# EAGLE design BatteryManagerV1 (EAGLE 5.12)

## Sheet 1 of 3
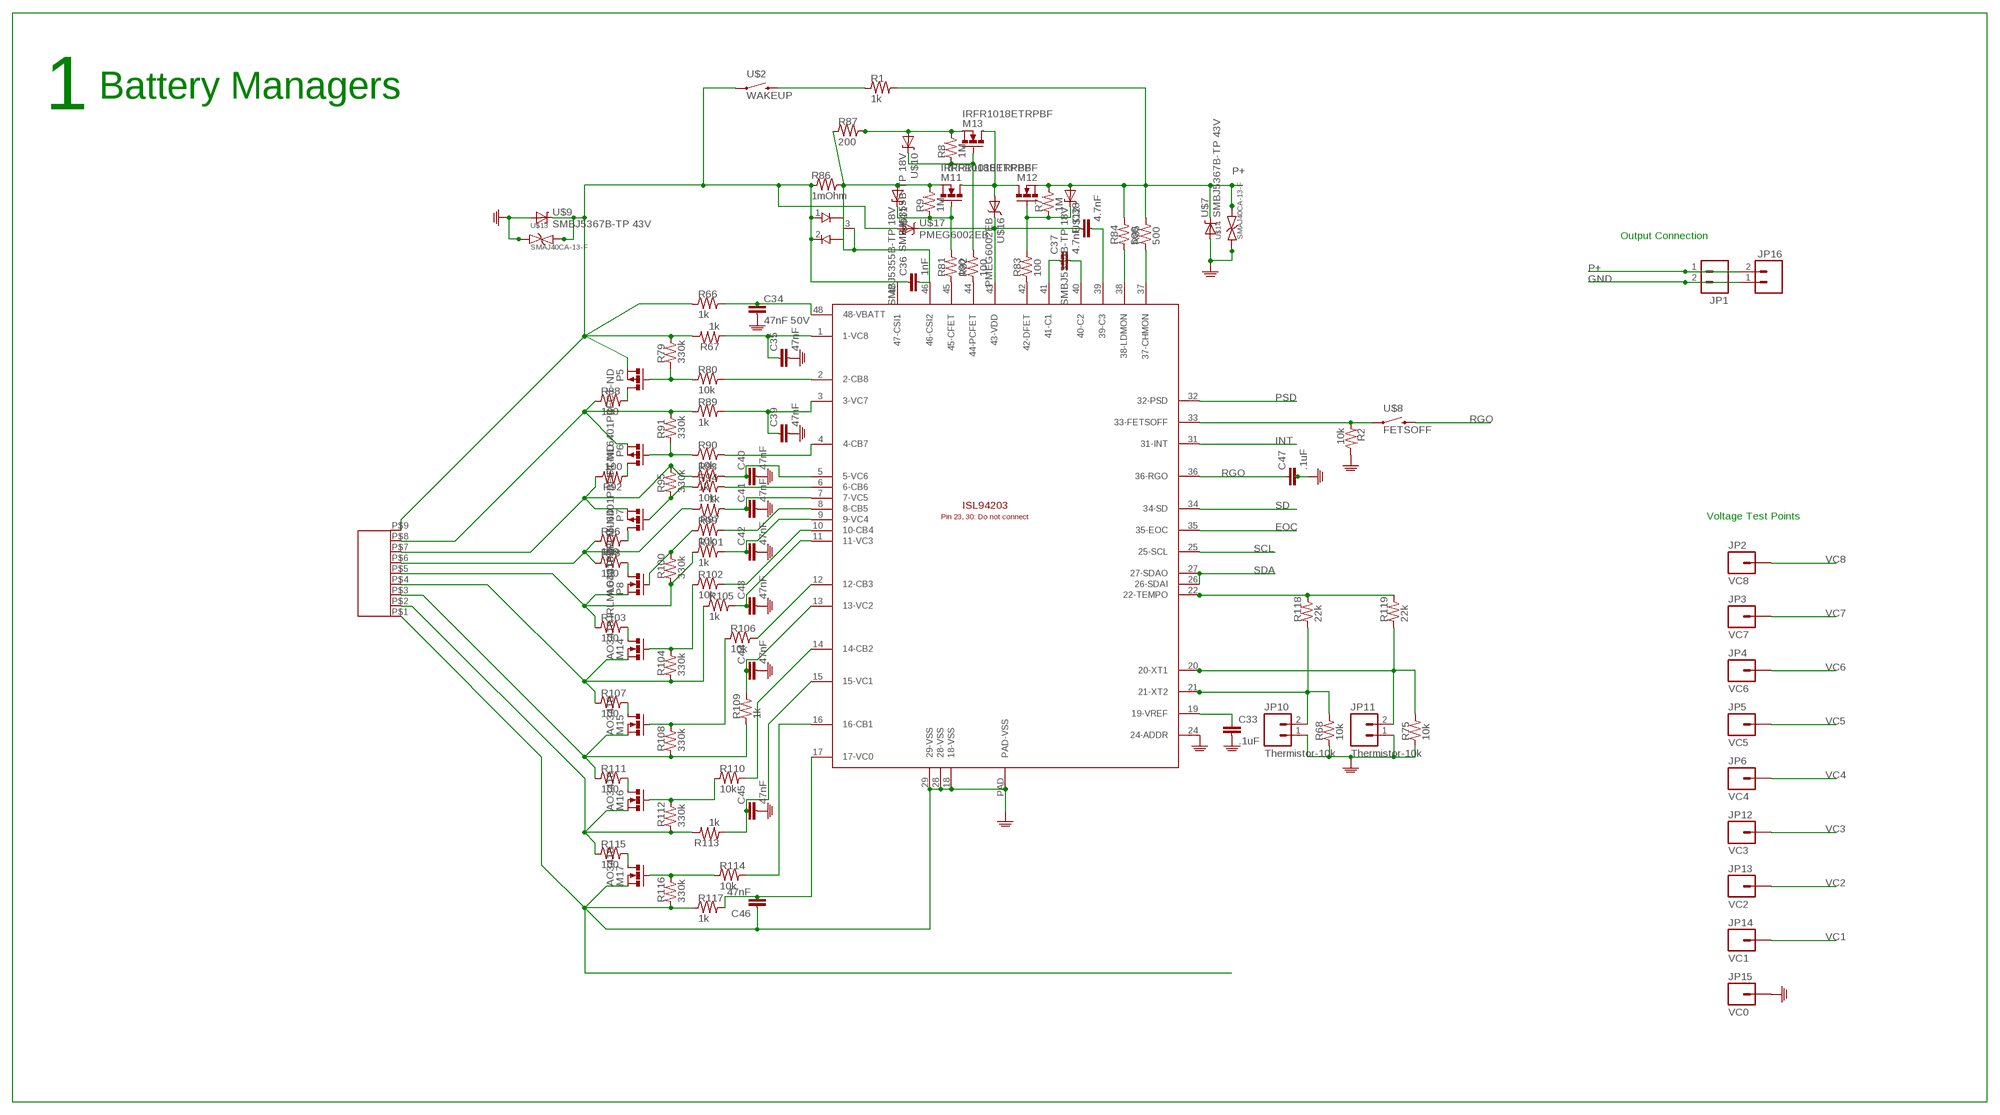
[diagram p0: schematic, sheet 1]

### Parts
C33  .1uF  CAP0603  [0603]
C34  47nF 50V  CAP0603  [0603]
C35  47nF  CAP0603  [0603]
C36  1nF  CAP0603  [0603]
C37  4.7nF  CAP0603  [0603]
C38  4.7nF  CAP0603  [0603]
C39  47nF  CAP0603  [0603]
C40  47nF  CAP0603  [0603]
C41  47nF  CAP0603  [0603]
C42  47nF  CAP0603  [0603]
C43  47nF  CAP0603  [0603]
C44  47nF  CAP0603  [0603]
C45  47nF  CAP0603  [0603]
C46  47nF  CAP0603  [0603]
C47  .1uF  CAP0603  [0603]
JP1  M02MINI-MATENLOK-2  [TE-MINIMATENLOK-2]
JP2  VC8  M01TEST  [1X01_TEST]
JP3  VC7  M01TEST  [1X01_TEST]
JP4  VC6  M01TEST  [1X01_TEST]
JP5  VC5  M01TEST  [1X01_TEST]
JP6  VC4  M01TEST  [1X01_TEST]
JP10  Thermistor-10k  M02JST-PH-TH  [JST-2-PH-TH]
JP11  Thermistor-10k  M02JST-PH-TH  [JST-2-PH-TH]
JP12  VC3  M01TEST  [1X01_TEST]
JP13  VC2  M01TEST  [1X01_TEST]
JP14  VC1  M01TEST  [1X01_TEST]
JP15  VC0  M01TEST  [1X01_TEST]
JP16  M02JST-PH-TH  [JST-2-PH-TH]
M11  IRFR1018ETRPBF  N-MOSDPAK  [DPAK]
M12  IRFR1018ETRPBF  N-MOSDPAK  [DPAK]
M13  IRFR1018ETRPBF  N-MOSDPAK  [DPAK]
M14  AO3418  N-MOSSOT23F  [SOT23F]
M15  AO3418  N-MOSSOT23F  [SOT23F]
M16  AO3418  N-MOSSOT23F  [SOT23F]
M17  AO3418  N-MOSSOT23F  [SOT23F]
P5  IRLML6401PBFCT-ND  P-MOSSOT23F  [SOT23F]
P6  IRLML6401PBFCT-ND  P-MOSSOT23F  [SOT23F]
P7  IRLML6401PBFCT-ND  P-MOSSOT23F  [SOT23F]
P8  AO3418  N-MOSSOT23F  [SOT23F]
R1  1k  R0603  [0603]
R2  10k  R0603  [0603]
R7  1M  R0603  [0603]
R8  1M  R0603  [0603]
R9  1M  R0603  [0603]
R66  1k  R0603  [0603]
R67  1k  R0603  [0603]
R68  10k  R0603  [0603]
R75  10k  R0603  [0603]
R79  330k  R0603  [0603]
R80  10k  R0603  [0603]
R81  100  R0603  [0603]
R82  100  R0603  [0603]
R83  100  R0603  [0603]
R84  500  R0603  [0603]
R85  500  R0603  [0603]
R86  1mOhm  R-SHORT1206  [1206]
R87  200  R0603  [0603]
R88  100  R0603  [0603]
R89  1k  R0603  [0603]
R90  10k  R0603  [0603]
R91  330k  R0603  [0603]
R92  100  R0603  [0603]
R93  1k  R0603  [0603]
R94  10k  R0603  [0603]
R95  330k  R0603  [0603]
R96  100  R0603  [0603]
R97  1k  R0603  [0603]
R98  100  R0603  [0603]
R99  10k  R0603  [0603]
R100  330k  R0603  [0603]
R101  1k  R0603  [0603]
R102  10k  R0603  [0603]
R103  100  R0603  [0603]
R104  330k  R0603  [0603]
R105  1k  R0603  [0603]
R106  10k  R0603  [0603]
R107  100  R0603  [0603]
R108  330k  R0603  [0603]
R109  1k  R0603  [0603]
R110  10k  R0603  [0603]
R111  100  R0603  [0603]
R112  330k  R0603  [0603]
R113  1k  R0603  [0603]
R114  10k  R0603  [0603]
R115  100  R0603  [0603]
R116  330k  R0603  [0603]
R117  1k  R0603  [0603]
R118  22k  R0603  [0603]
R119  22k  R0603  [0603]
U$1  JST-9-PH  [JST-9-PH]
U$2  WAKEUP  TACTILE_SWITCH  [TACTILE_SWITCH]
U$6  ISL94203  [TQFPNL-48]
U$7  SMBJ5367B-TP 43V  DIODE-ZENERSMB  [SMB-DIODE]
U$8  FETSOFF  TACTILE_SWITCH  [TACTILE_SWITCH]
U$9  SMBJ5367B-TP 43V  DIODE-ZENERSMB  [SMB-DIODE]
U$10  SMBJ5355B-TP 18V  DIODE-ZENERSMB  [SMB-DIODE]
U$11  SMBJ5355B-TP 18V  DIODE-ZENERSMB  [SMB-DIODE]
U$12  SMBJ5355B-TP 18V  DIODE-ZENERSMB  [SMB-DIODE]
U$13  SMAJ40CA-13-F  [SMA-DIODE]
U$14  SMAJ40CA-13-F  [SMA-DIODE]
U$15  MMBD7000HS-7-F  [SOT23-3]
U$16  PMEG6002EB  [SOD-523]
U$17  PMEG6002EB  [SOD-523]

### Nets
EOC: U$6.35(35-EOC) ; also sheet 2
GND: C33.2 C34.2 C35.2 C39.2 C40.2 C41.2 C42.2 C43.2 C44.2 C45.2 C46.1 C47.2 JP1.2 JP10.1 JP11.1 JP15.1 JP16.1 M17.S R2.2 R68.1 R75.1 R116.1 R117.1 U$1.P$1 U$6.18(18-VSS) U$6.24(24-ADDR) U$6.28(28-VSS) U$6.29(29-VSS) U$6.PAD(PAD-VSS) U$7.A U$9.A U$13.A U$14.A ; also sheet 2,3
INT: U$6.31(31-INT) ; also sheet 2
N$1: R1.1 U$2.2
N$2: R2.1 U$6.33(33-FETSOFF) U$8.1
N$4: M11.D M12.D M13.D U$16.A
N$7: C36.2 M11.S R9.2 R86.2 R87.1 U$6.46(46-CSI2) U$11.A U$15.3
N$92: C33.1 U$6.19(19-VREF)
N$93: C34.1 R66.2 U$6.48(48-VBATT)
N$94: C35.1 R67.1 U$6.1(1-VC8)
N$105: R80.2 U$6.2(2-CB8)
N$106: P5.G R79.1 R80.1
N$107: C39.1 R89.2 U$6.3(3-VC7)
N$110: M11.G R9.1 R81.2 U$11.C
N$111: M13.G R8.1 R82.2 U$10.C
N$112: C38.1 U$6.43(43-VDD) U$16.C U$17.C
N$113: M12.G R7.1 R83.2 U$12.C
N$114: C37.1 U$6.41(41-C1)
N$115: C37.2 U$6.40(40-C2)
N$116: C38.2 U$6.39(39-C3)
N$117: R84.1 U$6.38(38-LDMON)
N$118: R85.1 U$6.37(37-CHMON)
N$119: M13.S R8.2 R87.2 U$10.A
N$120: P5.D R88.2
N$121: R90.2 U$6.4(4-CB7)
N$123: P6.G R90.1 R91.1
N$124: P6.D R92.1
N$126: P7.G R94.1 R95.1
N$127: R94.2 U$6.6(6-CB6)
N$128: C40.1 R93.2 U$6.5(5-VC6)
N$129: P7.D R96.2
N$130: C41.1 R97.1 U$6.7(7-VC5)
N$132: P8.D R98.2
N$133: R99.2 U$6.8(8-CB5)
N$134: P8.G R99.1 R100.2
N$135: C42.1 R101.2 U$6.9(9-VC4)
N$137: R102.2 U$6.10(10-CB4)
N$138: M14.G R102.1 R104.2
N$139: M14.D R103.2
N$140: C43.1 R105.2 U$6.11(11-VC3)
N$142: R106.2 U$6.12(12-CB3)
N$143: M15.G R106.1 R108.2
N$144: M15.D R107.2
N$145: C44.1 R109.2 U$6.13(13-VC2)
N$147: M16.G R110.1 R112.2
N$148: R110.2 U$6.14(14-CB2)
N$149: M16.D R111.2
N$150: C45.1 R113.1 U$6.15(15-VC1)
N$152: R114.2 U$6.16(16-CB1)
N$153: M17.G R114.1 R116.2
N$154: M17.D R115.2
N$155: C46.2 R117.2 U$6.17(17-VC0)
N$156: R81.1 U$6.45(45-CFET)
N$157: R82.1 U$6.44(44-PCFET)
N$158: R83.1 U$6.42(42-DFET)
N$159: R118.2 R119.2 U$6.22(22-TEMPO)
N$160: JP11.2 R75.2 R119.1 U$6.20(20-XT1)
N$161: JP10.2 R68.2 R118.1 U$6.21(21-XT2)
P+: JP1.1 JP16.2 M12.S R1.2 R7.2 R84.2 R85.2 U$7.C U$12.A U$14.C
PSD: U$6.32(32-PSD) ; also sheet 2
RGO: C47.1 U$6.36(36-RGO) U$8.2 ; also sheet 2
SCL: U$6.25(25-SCL) ; also sheet 2
SD: U$6.34(34-SD) ; also sheet 2
SDA: U$6.26(26-SDAI) U$6.27(27-SDAO) ; also sheet 2
VC1: JP14.1 M16.S R112.1 R113.2 R115.1 U$1.P$2
VC2: JP13.1 M15.S R108.1 R109.1 R111.1 U$1.P$3
VC3: JP12.1 M14.S R104.1 R105.1 R107.1 U$1.P$4
VC4: JP6.1 P8.S R100.1 R101.1 R103.1 U$1.P$5
VC5: JP5.1 R96.1 R97.2 R98.1 U$1.P$6
VC6: JP4.1 P7.S R92.2 R93.1 R95.2 U$1.P$7
VC7: JP3.1 P6.S R88.1 R89.1 R91.2 U$1.P$8
VC8: C36.1 JP2.1 P5.S R66.1 R67.2 R79.2 R86.1 U$1.P$9 U$2.1 U$6.47(47-CSI1) U$9.C U$13.C U$15.1 U$15.2 U$17.A

### Notes on the sheet
- 1 | Battery Managers
- Output Connection
- Voltage Test Points

## Sheet 2 of 3
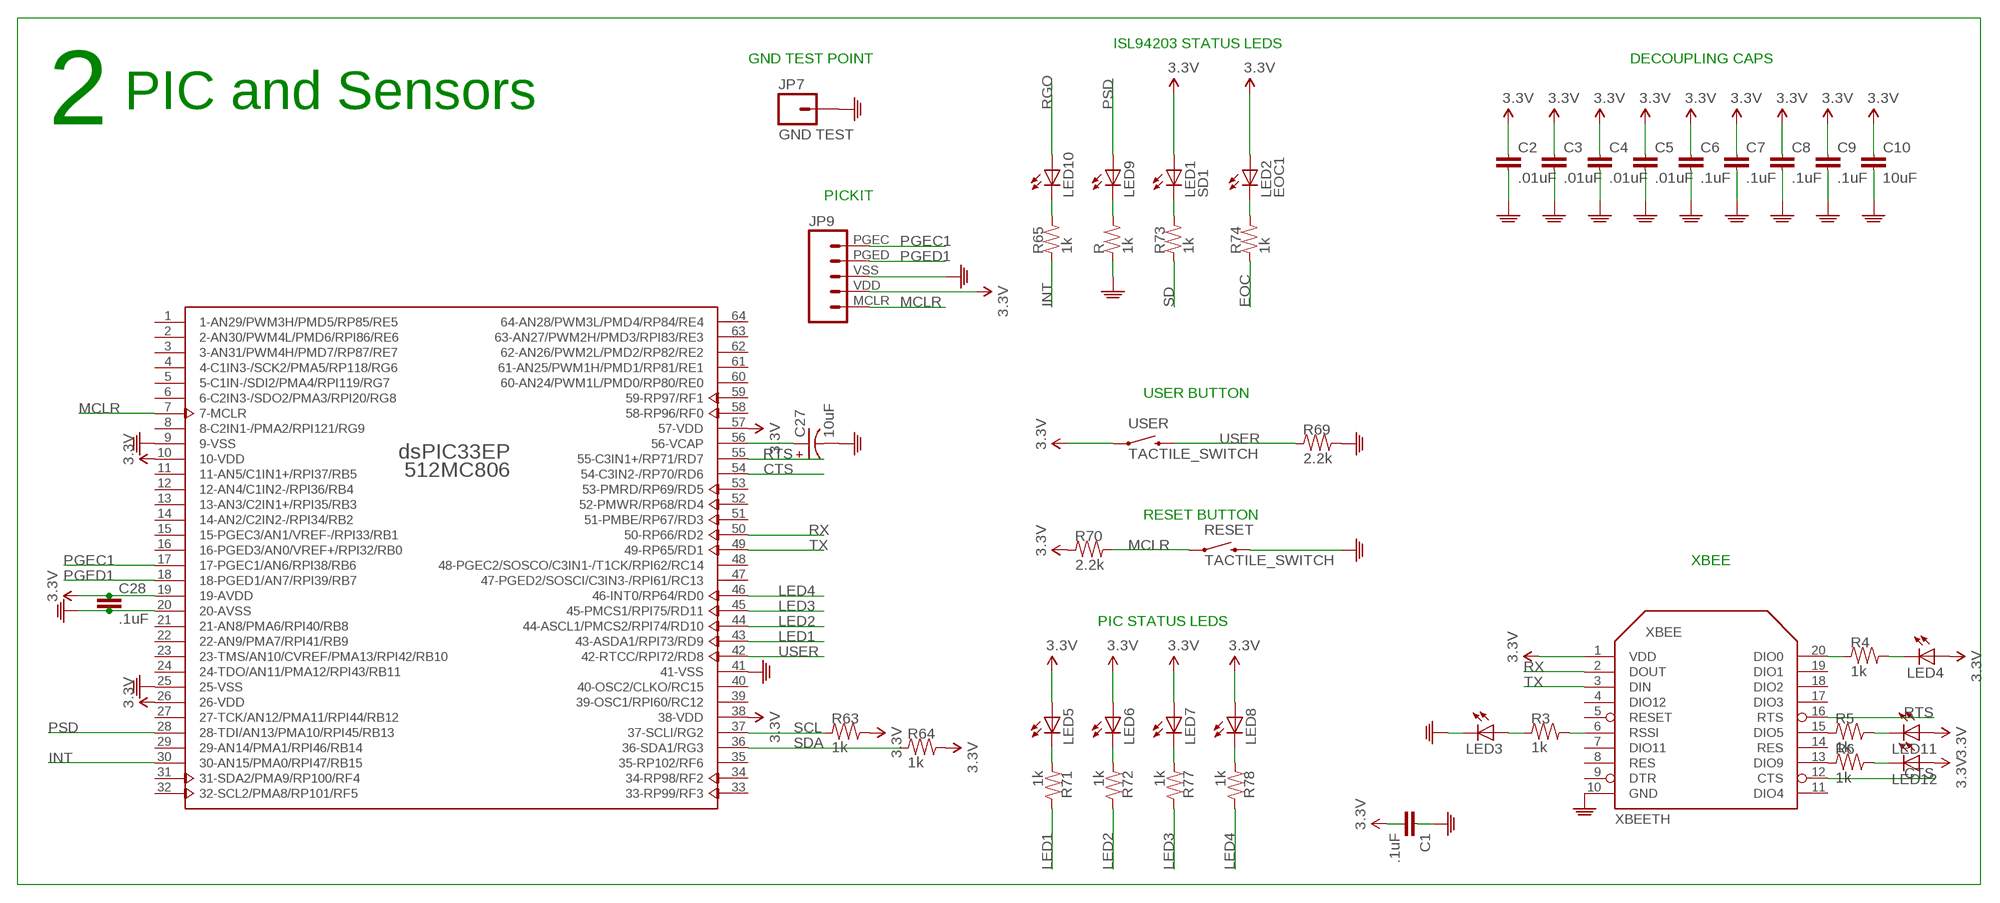
[diagram p1: schematic, sheet 2]

### Parts
C1  .1uF  CAP1206  [1206]
C2  .01uF  CAP0603  [0603]
C3  .01uF  CAP0603  [0603]
C4  .01uF  CAP0603  [0603]
C5  .01uF  CAP0603  [0603]
C6  .1uF  CAP0603  [0603]
C7  .1uF  CAP0603  [0603]
C8  .1uF  CAP0603  [0603]
C9  .1uF  CAP0603  [0603]
C10  10uF  CAP1206  [1206]
C27  10uF  CAP-POL0603  [0603-POL]
C28  .1uF  CAP0603  [0603]
JP7  GND TEST  M01PTH  [1X01]
JP9  M05PICKIT3  [1X05-PICKIT3]
LED1  SD1  LED0603  [0603-DIODE]
LED2  EOC1  LED0603  [0603-DIODE]
LED3  LED0603  [0603-DIODE]
LED4  LED0603  [0603-DIODE]
LED5  LED5MM  [LED5MM]
LED6  LED5MM  [LED5MM]
LED7  LED5MM  [LED5MM]
LED8  LED5MM  [LED5MM]
LED9  LED0603  [0603-DIODE]
LED10  LED0603  [0603-DIODE]
LED11  LED0603  [0603-DIODE]
LED12  LED0603  [0603-DIODE]
R  1k  R0603  [0603]
R3  1k  R0603  [0603]
R4  1k  R0603  [0603]
R5  1k  R0603  [0603]
R6  1k  R0603  [0603]
R63  1k  R0402  [0402]
R64  1k  R0402  [0402]
R65  1k  R0603  [0603]
R69  2.2k  R0603  [0603]
R70  2.2k  R0603  [0603]
R71  1k  R0603  [0603]
R72  1k  R0603  [0603]
R73  1k  R0603  [0603]
R74  1k  R0603  [0603]
R77  1k  R0603  [0603]
R78  1k  R0603  [0603]
RESET  TACTILE_SWITCH  [TACTILE_SWITCH]
U$3  DSPIC33EP512MC806  [TQFP64_10X10]
USER  TACTILE_SWITCH  [TACTILE_SWITCH]
XBEE  XBEETH  [XBEE-SILK]

### Nets
3.3V: C1.2 C2.1 C3.1 C4.1 C5.1 C6.1 C7.1 C8.1 C9.1 C10.1 C28.1 JP9.VDD LED1.AN(A) LED2.AN(A) LED4.AN(A) LED5.A LED6.A LED7.A LED8.A LED11.AN(A) LED12.AN(A) R63.2 R64.2 R70.1 U$3.10(10-VDD) U$3.19(19-AVDD) U$3.26(26-VDD) U$3.38(38-VDD) U$3.57(57-VDD) USER.1 XBEE.1(VDD) ; also sheet 3
CTS: U$3.54(54-C3IN2-/RP70/RD6) XBEE.12(CTS)
EOC: R74.1 ; also sheet 1
GND: C1.1 C2.2 C3.2 C4.2 C5.2 C6.2 C7.2 C8.2 C9.2 C10.2 C27.- C28.2 JP7.1 JP9.VSS LED3.CAT(C) R69.2 R.1 RESET.2 U$3.9(9-VSS) U$3.20(20-AVSS) U$3.25(25-VSS) U$3.41(41-VSS) XBEE.10(GND) ; also sheet 1,3
INT: R65.1 U$3.30(30-AN15/PMA0/RPI47/RB15) ; also sheet 1
LED1: R71.2 U$3.43(43-ASDA1/RPI73/RD9)
LED2: R72.2 U$3.44(44-ASCL1/PMCS2/RPI74/RD10)
LED3: R77.2 U$3.45(45-PMCS1/RPI75/RD11)
LED4: R78.2 U$3.46(46-INT0/RP64/RD0)
MCLR: JP9.MCLR R70.2 RESET.1 U$3.7(7-MCLR)
N$3: R4.1 XBEE.20(DIO0)
N$5: LED3.AN(A) R3.1
N$6: R3.2 XBEE.6(RSSI)
N$8: LED4.CAT(C) R4.2
N$9: LED11.CAT(C) R5.2
N$10: LED12.CAT(C) R6.2
N$11: R5.1 XBEE.15(DIO5)
N$12: R6.1 XBEE.13(DIO9)
N$35: C27.+ U$3.56(56-VCAP)
N$86: LED5.K(C) R71.1
N$90: LED10.CAT(C) R65.2
N$91: LED9.CAT(C) R.2
N$96: LED1.CAT(C) R73.2
N$97: LED6.K(C) R72.1
N$98: LED2.CAT(C) R74.2
N$99: LED7.K(C) R77.1
N$102: LED8.K(C) R78.1
PGEC1: JP9.PGEC U$3.17(17-PGEC1/AN6/RPI38/RB6)
PGED1: JP9.PGED U$3.18(18-PGED1/AN7/RPI39/RB7)
PSD: LED9.AN(A) U$3.28(28-TDI/AN13/PMA10/RPI45/RB13) ; also sheet 1
RGO: LED10.AN(A) ; also sheet 1
RTS: U$3.55(55-C3IN1+/RP71/RD7) XBEE.16(RTS)
RX: U$3.50(50-RP66/RD2) XBEE.2(DOUT)
SCL: R63.1 U$3.37(37-SCLI/RG2) ; also sheet 1
SD: R73.1 ; also sheet 1
SDA: R64.1 U$3.36(36-SDA1/RG3) ; also sheet 1
TX: U$3.49(49-RP65/RD1) XBEE.3(DIN)
USER: R69.1 U$3.42(42-RTCC/RPI72/RD8) USER.2
Unconnected: U$3.1(1-AN29/PWM3H/PMD5/RP85/RE5) U$3.2(2-AN30/PWM4L/PMD6/RPI86/RE6) U$3.3(3-AN31/PWM4H/PMD7/RP87/RE7) U$3.4(4-C1IN3-/SCK2/PMA5/RP118/RG6) U$3.5(5-C1IN-/SDI2/PMA4/RPI119/RG7) U$3.6(6-C2IN3-/SDO2/PMA3/RPI20/RG8) U$3.8(8-C2IN1-/PMA2/RPI121/RG9) U$3.11(11-AN5/C1IN1+/RPI37/RB5) U$3.12(12-AN4/C1IN2-/RPI36/RB4) U$3.13(13-AN3/C2IN1+/RPI35/RB3) U$3.14(14-AN2/C2IN2-/RPI34/RB2) U$3.15(15-PGEC3/AN1/VREF-/RPI33/RB1) U$3.16(16-PGED3/AN0/VREF+/RPI32/RB0) U$3.21(21-AN8/PMA6/RPI40/RB8) U$3.22(22-AN9/PMA7/RPI41/RB9) U$3.23(23-TMS/AN10/CVREF/PMA13/RPI42/RB10) U$3.24(24-TDO/AN11/PMA12/RPI43/RB11) U$3.27(27-TCK/AN12/PMA11/RPI44/RB12) U$3.29(29-AN14/PMA1/RPI46/RB14) U$3.31(31-SDA2/PMA9/RP100/RF4) U$3.32(32-SCL2/PMA8/RP101/RF5) U$3.33(33-RP99/RF3) U$3.34(34-RP98/RF2) U$3.35(35-RP102/RF6) U$3.39(39-OSC1/RPI60/RC12) U$3.40(40-OSC2/CLKO/RC15) U$3.47(47-PGED2/SOSCI/C3IN3-/RPI61/RC13) U$3.48(48-PGEC2/SOSCO/C3IN1-/T1CK/RPI62/RC14) U$3.51(51-PMBE/RP67/RD3) U$3.52(52-PMWR/RP68/RD4) U$3.53(53-PMRD/RP69/RD5) U$3.58(58-RP96/RF0) U$3.59(59-RP97/RF1) U$3.60(60-AN24/PWM1L/PMD0/RP80/RE0) U$3.61(61-AN25/PWM1H/PMD1/RP81/RE1) U$3.62(62-AN26/PWM2L/PMD2/RP82/RE2) U$3.63(63-AN27/PWM2H/PMD3/RPI83/RE3) U$3.64(64-AN28/PWM3L/PMD4/RP84/RE4) XBEE.4(DIO12) XBEE.5(RESET) XBEE.7(DIO11) XBEE.8(RES) XBEE.9(DTR) XBEE.11(DIO4) XBEE.14(RES) XBEE.17(DIO3) XBEE.18(DIO2) XBEE.19(DIO1)

### Notes on the sheet
- ISL94203 STATUS LEDS
- GND TEST POINT | DECOUPLING CAPS
- 2 | PIC and Sensors
- PICKIT
- USER BUTTON
- RESET BUTTON
- XBEE
- PIC STATUS LEDS

## Sheet 3 of 3
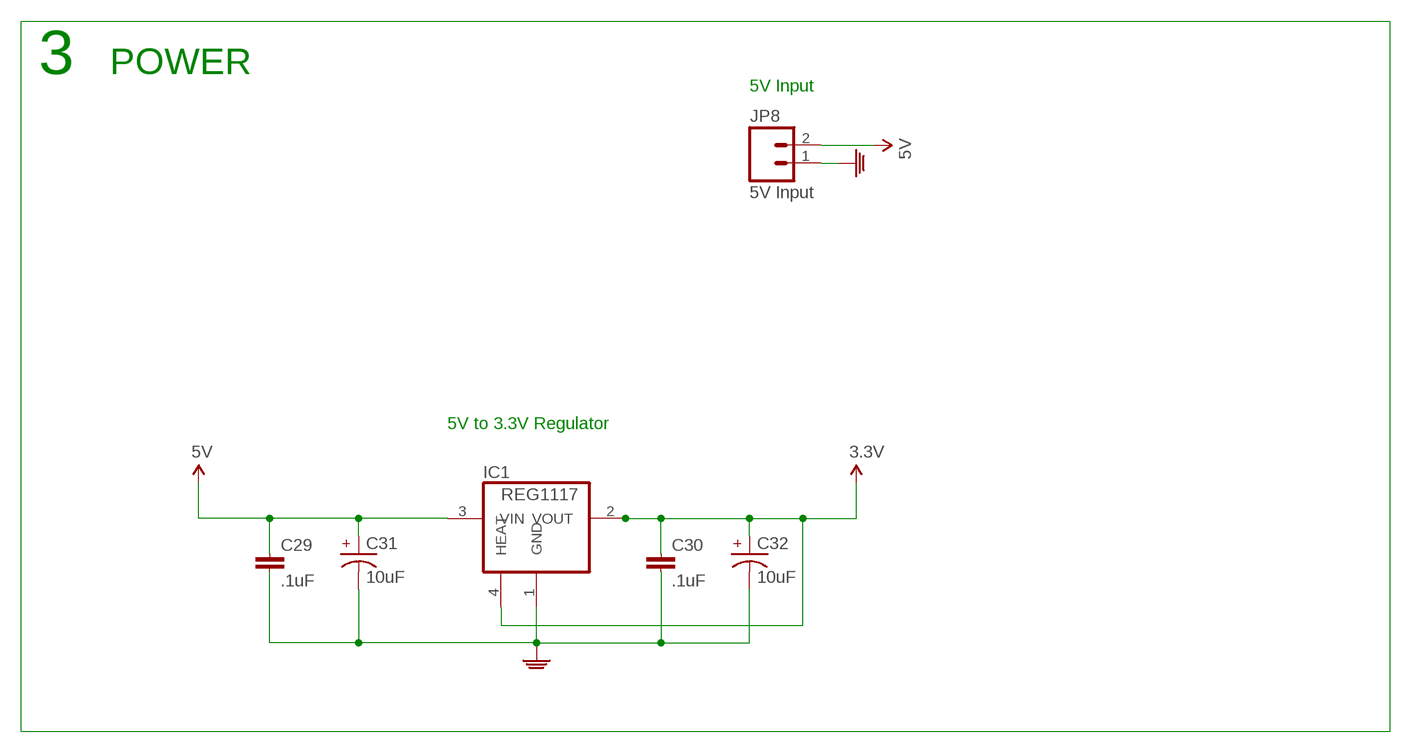
[diagram p2: schematic, sheet 3]

### Parts
C29  .1uF  CAP1206  [1206]
C30  .1uF  CAP1206  [1206]
C31  10uF  CAP-POL0603  [0603-POL]
C32  10uF  CAP-POL0603  [0603-POL]
IC1  REG1117  [SOT223]
JP8  5V Input  M02JST-PH-TH  [JST-2-PH-TH]

### Nets
3.3V: C30.1 C32.+ IC1.2(VOUT) IC1.4(HEAT) ; also sheet 2
5V: C29.1 C31.+ IC1.3(VIN) JP8.2
GND: C29.2 C30.2 C31.- C32.- IC1.1(GND) JP8.1 ; also sheet 1,2

### Notes on the sheet
- 3 | POWER
- 5V Input
- 5V to 3.3V Regulator

## Library data of the parts
C1-C10 C28-C30 C34-C47 = GibbotV5:CAP: Capacitor Standard 0603 ceramic capacitor, and 0.1" leaded capacitor.
C27 C31 C32 = GibbotV5:CAP-POL: CAPACITOR, American symbol
C33 = Gibbot v4:CAP: Capacitor Standard 0603 ceramic capacitor, and 0.1" leaded capacitor.
IC1 = GibbotV5:REG1117: 800mA and 1A Low Dropout (LDO) Positive Regulator 1.8V, 2.5V, 2.85V, 3.3V, 5V, and Adj
JP1 JP8 JP10 JP11 JP16 = GibbotV5:M02: Header 2 Standard 2-pin 0.1" header. Use with straight break away headers (SKU : PRT-00116), right angle break away headers (PRT-00553), swiss pins (PRT-00743), machine pins (PRT-00117), and female headers (PRT-00115). Molex polarized connector foot print use with SKU : PRT-08233 with associated crimp pins and housings.
JP2-JP7 JP12-JP15 = GibbotV5:M01: Header 1 Standard 1-pin 0.1" header. Use with straight break away headers (SKU : PRT-00116), right angle break away headers (PRT-00553), swiss pins (PRT-00743), machine pins (PRT-00117), and female headers (PRT-00115).
JP9 = GibbotV5:M05: Header 5 Standard 5-pin 0.1" header. Use with straight break away headers (SKU : PRT-00116), right angle break away headers (PRT-00553), swiss pins (PRT-00743), machine pins (PRT-00117), and female headers (PRT-00115). Molex polarized connector foot print use with SKU : PRT-08230 with associated crimp pins and housings.
LED1-LED12 = GibbotV5:LED: LEDs Standard schematic elements and footprints for 5mm, 3mm, 1206, and 0603 sized LEDs. 5mm - Spark Fun Electronics SKU : COM-00529 (and others)
M11-M13 = Gibbot v4:N-MOS
M14-M17 P8 = GibbotV5:N-MOS
P5-P7 = GibbotV5:P-MOS
R R1-R9 R63-R75 R77-R85 R87-R119 = GibbotV5:R: RESISTOR, American symbol
R86 = GibbotV5:R-SHORT
RESET U$2 U$8 USER = GibbotV5:TACTILE_SWITCH
U$1 = GibbotV6:JST-9-PH
U$3 = GibbotV5:DSPIC33EP512MC806
U$6 = Gibbot v4:ISL94203
U$7 U$9-U$12 = GibbotV5:DIODE-ZENER: Zener Diode Production Part - 8199 3.4V Zener Voltage
U$13 U$14 = GibbotV5:SMAJ40CA-13-F
U$15 = GibbotV5:MMBD7000HS-7-F
U$16 U$17 = GibbotV5:PMEG6002EB
XBEE = GibbotV5:XBEE

## Board
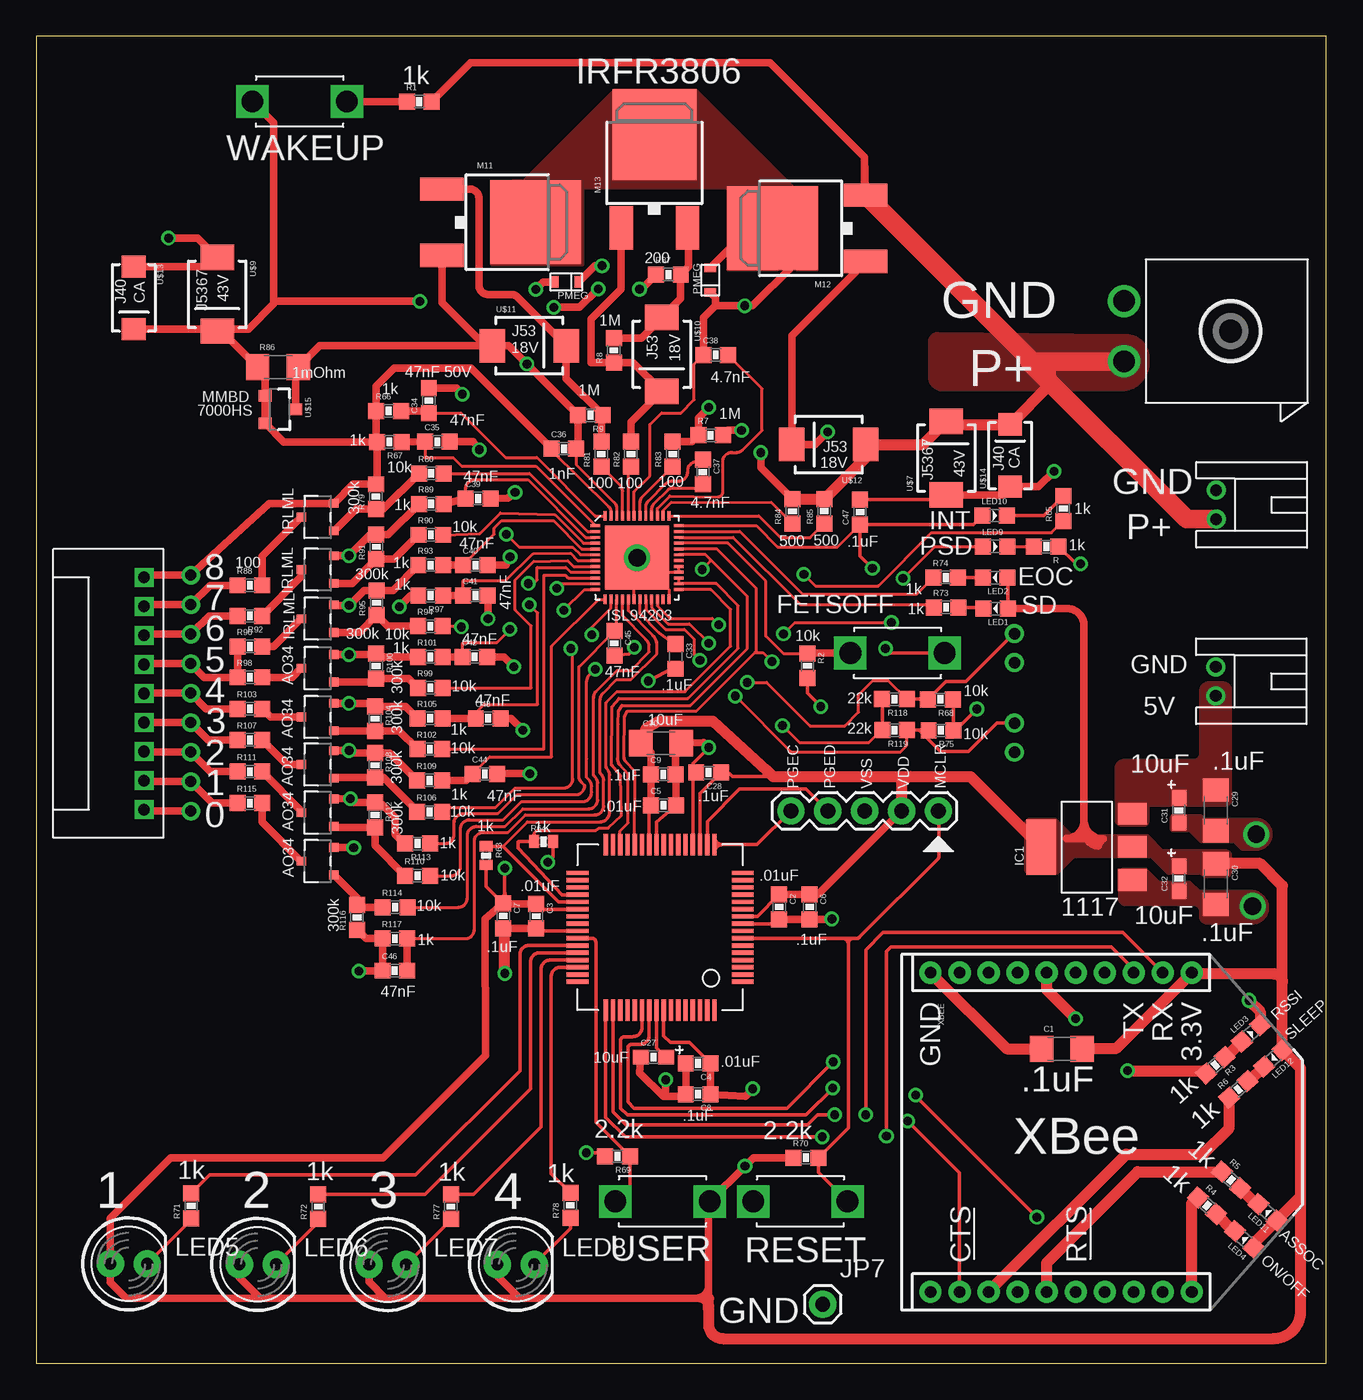
[diagram p3: board, top side]
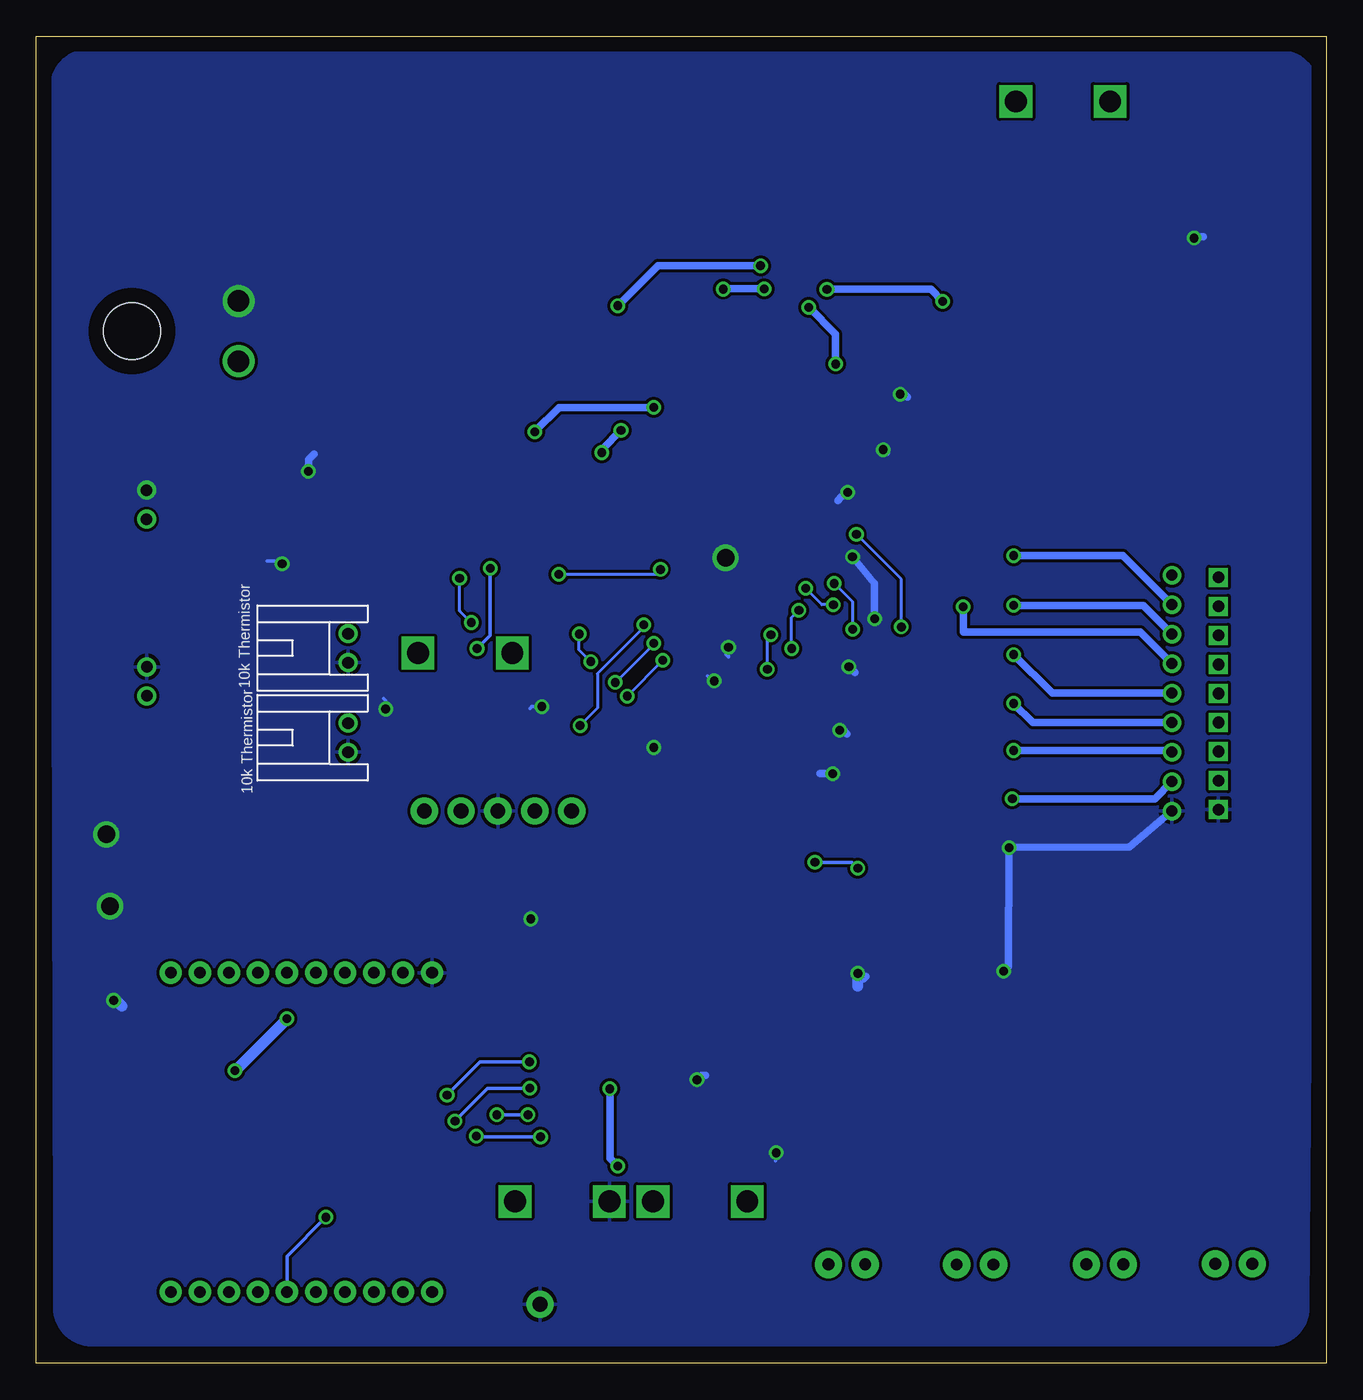
[diagram p4: board, bottom side, seen from below]

Size 88.9 x 91.44 mm. Coordinates in mm from the lower left corner, seen from the top.
Outline: 0,0 88.9,0 88.9,91.44 0,91.44 0,0
Copper layers (1*16): Top 0.035mm / dielectric 1.5mm / Bottom 0.035mm
Design rules "default *": minimum track width 8mil, minimum drill 20mil, track to track 8mil, track to pad 8mil, pad to pad 5mil, via to via 8mil, smd to smd 8mil, copper to edge 40mil, drill to drill 8mil, minimum pad ring 10mil, minimum via ring 8mil, stop-mask expansion 4mil, vias tented up to drill 0mil, thermal gap 10mil

### Footprints (pad centres in the part's own frame; a part is rotated, then mirrored left to right if it is on the bottom)
1206 = smd 1.6 x 1.8: 1 -1.4,0; 2 1.4,0
0603 = smd 1.1 x 1.1: 1 -0.85,0; 2 0.85,0
0603-POL = smd 1.1 x 1: + 0.85,0; - -0.85,0
SOT223 = smd 1.499 x 2.007: 1 -2.261,-3.15; 2 0.025,-3.15; 3 2.311,-3.15 | smd 3.81 x 2.007: 4 0,3.15
TE-MINIMATENLOK-2 = drill 1.48 round: 1 -2.07,12.67; 2 2.07,12.67 | hole 3.91: 0,5.33
1X01_TEST = drill 0.762 round: 1 0,0
1X01 = drill 1.016 pad 1.88 round: 1 0,0
JST-2-PH-TH = drill 0.8 round: 1 -1,-6.35; 2 1,-6.35
1X05-PICKIT3 = drill 1.016 pad 1.88 round: MCLR 1.27,-1.016; PGEC 11.43,-1.016; PGED 8.89,-1.016; VDD 3.81,-1.016; VSS 6.35,-1.016
0603-DIODE = smd 1.1 x 1.1: AN -0.85,0; CAT 0.85,0
LED5MM = drill 0.813 pad 1.88 round: A -1.27,0; K 1.27,0
DPAK = smd 5.791 x 6.274: D 0,1.587 | smd 1.6 x 3: G -2.286,-4.851; S 2.286,-4.851
SOT23F = smd 0.6 x 0.65: D 0,1.125; G -0.95,-1.125; S 0.95,-1.125
0402 = smd 0.7 x 0.9: 1 -0.65,0; 2 0.65,0
TACTILE_SWITCH = drill 1.5 square: 1 -3.25,0; 2 3.25,0
JST-9-PH = drill 0.8 square: P$1 -8,0; P$2 -6,0; P$3 -4,0; P$4 -2,0; P$5 0,0; P$6 2,0; P$7 4,0; P$8 6,0; P$9 8,0
TQFP64_10X10 = smd 1.5 x 0.3: 1 -5.7,3.75; 2 -5.7,3.25; 3 -5.7,2.75; 4 -5.7,2.25; 5 -5.7,1.75; 6 -5.7,1.25; 7 -5.7,0.75; 8 -5.7,0.25; 9 -5.7,-0.25; 10 -5.7,-0.75; 11 -5.7,-1.25; 12 -5.7,-1.75; 13 -5.7,-2.25; 14 -5.7,-2.75; 15 -5.7,-3.25; 16 -5.7,-3.75; 33 5.7,-3.75; 34 5.7,-3.25; 35 5.7,-2.75; 36 5.7,-2.25; 37 5.7,-1.75; 38 5.7,-1.25; 39 5.7,-0.75; 40 5.7,-0.25; 41 5.7,0.25; 42 5.7,0.75; 43 5.7,1.25; 44 5.7,1.75; 45 5.7,2.25; 46 5.7,2.75; 47 5.7,3.25; 48 5.7,3.75 | smd 0.3 x 1.5: 17 -3.75,-5.7; 18 -3.25,-5.7; 19 -2.75,-5.7; 20 -2.25,-5.7; 21 -1.75,-5.7; 22 -1.25,-5.7; 23 -0.75,-5.7; 24 -0.25,-5.7; 25 0.25,-5.7; 26 0.75,-5.7; 27 1.25,-5.7; 28 1.75,-5.7; 29 2.25,-5.7; 30 2.75,-5.7; 31 3.25,-5.7; 32 3.75,-5.7; 49 3.75,5.7; 50 3.25,5.7; 51 2.75,5.7; 52 2.25,5.7; 53 1.75,5.7; 54 1.25,5.7; 55 0.75,5.7; 56 0.25,5.7; 57 -0.25,5.7; 58 -0.75,5.7; 59 -1.25,5.7; 60 -1.75,5.7; 61 -2.25,5.7; 62 -2.75,5.7; 63 -3.25,5.7; 64 -3.75,5.7
TQFPNL-48 = smd 0.65 x 0.2: 1 -2.875,2.2; 2 -2.875,1.8; 3 -2.875,1.4; 4 -2.875,1; 5 -2.875,0.6; 6 -2.875,0.2; 7 -2.875,-0.2; 8 -2.875,-0.6; 9 -2.875,-1; 10 -2.875,-1.4; 11 -2.875,-1.8; 12 -2.875,-2.2; 25 2.875,-2.2; 26 2.875,-1.8; 27 2.875,-1.4; 28 2.875,-1; 29 2.875,-0.6; 30 2.875,-0.2; 31 2.875,0.2; 32 2.875,0.6; 33 2.875,1; 34 2.875,1.4; 35 2.875,1.8; 36 2.875,2.2 | smd 0.2 x 0.65: 13 -2.2,-2.875; 14 -1.8,-2.875; 15 -1.4,-2.875; 16 -1,-2.875; 17 -0.6,-2.875; 18 -0.2,-2.875; 19 0.2,-2.875; 20 0.6,-2.875; 21 1,-2.875; 22 1.4,-2.875; 23 1.8,-2.875; 24 2.2,-2.875; 37 2.2,2.875; 38 1.8,2.875; 39 1.4,2.875; 40 1,2.875; 41 0.6,2.875; 42 0.2,2.875; 43 -0.2,2.875; 44 -0.6,2.875; 45 -1,2.875; 46 -1.4,2.875; 47 -1.8,2.875; 48 -2.2,2.875 | smd 4.4 x 4.4: PAD 0,0
SMB-DIODE = smd 1.75 x 2.3: A -2.54,0; C 2.54,0
SMA-DIODE = smd 1.52 x 1.63: A -2.15,0; C 2.15,0
SOT23-3 = smd 0.8 x 0.9: 1 -0.95,-1; 2 0.95,-1; 3 0,1.1
SOD-523 = smd 0.6 x 0.8: A 0.85,0; C -0.85,0
XBEE-SILK = drill 0.8 pad 1.524 round: 1 -11,20; 2 -11,18; 3 -11,16; 4 -11,14; 5 -11,12; 6 -11,10; 7 -11,8; 8 -11,6; 9 -11,4; 10 -11,2; 11 11,2; 12 11,4; 13 11,6; 14 11,8; 15 11,10; 16 11,12; 17 11,14; 18 11,16; 19 11,18; 20 11,20

### Placement (x,y rotation side)
C1  70.68,21.67 0 top
C2  51.19,31.45 270 top
C3  34.46,30.81 270 top
C4  45.61,20.66 180 top
C5  43.22,38.44 0 top
C6  53.29,31.45 270 top
C7  32.18,30.82 270 top
C8  45.61,18.54 180 top
C9  43.21,40.58 0 top
C10  43.05,42.72 0 top
C27  42.53,21.09 0 top
C28  46.33,40.7 180 top
C29  81.28,38.1 270 top
C30  81.28,33.02 270 top
C31  78.74,38.1 90 top
C32  78.74,33.4 90 top
C33  44.06,48.7 270 top
C34  27.05,66.33 90 top
C35  27.64,63.5 0 top
C36  36.36,63.02 0 top
C37  45.94,61.42 270 top
C38  46.82,69.48 0 top
C39  30.44,59.59 0 top
C40  30.26,54.99 0 top
C41  30.26,52.9 0 top
C42  30.21,48.68 0 top
C43  31.14,44.44 0 top
C44  30.91,40.6 0 top
C45  39.84,49.61 270 top
C46  24.7,27.05 0 top
C47  56.77,58.65 90 top
IC1  72.39,35.56 90 top
JP1  87.63,71.12 90 top
JP2  10.64,54.31 0 top
JP3  10.64,52.27 0 top
JP4  10.64,50.24 0 top
JP5  10.64,48.21 0 top
JP6  10.64,46.18 0 top
JP7  54.19,4.06 0 top
JP8  87.63,46.99 270 top
JP9  63.44,37.05 180 top
JP10  73.76,49.28 90 bottom
JP11  73.76,43.1 90 bottom
JP12  10.64,44.15 0 top
JP13  10.64,42.11 0 top
JP14  10.64,40.08 0 top
JP15  10.64,38.05 0 top
JP16  87.66,59.16 270 top
LED1  66.1,52.01 180 top
LED2  66.08,54.14 180 top
LED3  83.71,22.73 42 top
LED4  83.24,8.53 138 top
LED5  6.38,6.85 0 top
LED6  15.27,6.81 0 top
LED7  24.21,6.79 0 top
LED8  33.05,6.81 0 top
LED9  66.08,56.29 0 top
LED10  66.04,58.41 0 top
LED11  84.85,10.4 138 top
LED12  85.24,21.02 222 top
M11  32.8,78.63 270 top
M12  52.31,78.21 90 top
M13  42.6,83.07 0 top
M14  19.39,44.53 90 top
M15  19.39,41.26 90 top
M16  19.39,37.93 90 top
M17  19.39,34.59 90 top
P5  19.39,58.31 90 top
P6  19.39,54.69 90 top
P7  19.39,51.31 90 top
P8  19.39,47.89 90 top
R  69.6,56.27 180 top
R1  26.39,86.93 0 top
R2  53.14,48.06 270 top
R3  81.25,20.54 222 top
R4  80.68,10.86 318 top
R5  82.33,12.62 318 top
R6  82.83,18.87 42 top
R7  46.47,63.94 0 top
R8  39.8,69.8 90 top
R9  38.19,65.33 180 top
R63  31,34.98 270 top
R64  34.96,35.94 0 top
R65  70.78,58.89 90 top
R66  24.28,65.62 0 top
R67  24.33,63.49 180 top
R68  62.31,45.75 180 top
R69  40.06,14.26 180 top
R70  53.04,14.16 0 top
R71  10.68,10.85 90 top
R72  19.43,10.79 90 top
R73  62.7,52.08 0 top
R74  62.67,54.14 0 top
R75  62.34,43.61 180 top
R77  28.57,10.79 90 top
R78  36.8,10.88 90 top
R79  23.41,59.72 90 top
R80  27.22,61.32 0 top
R81  38.94,62.65 90 top
R82  40.98,62.65 90 top
R83  43.85,62.65 90 top
R84  52.11,58.7 90 top
R85  54.31,58.71 90 top
R86  16.66,68.64 0 top
R87  43.56,75.02 0 top
R88  14.72,53.61 0 top
R89  27.22,59.22 0 top
R90  27.19,57.09 0 top
R91  23.43,56.26 90 top
R92  14.72,51.5 180 top
R93  27.18,54.99 0 top
R94  27.15,50.79 0 top
R95  23.46,52.4 90 top
R96  14.72,49.39 0 top
R97  27.18,52.9 180 top
R98  14.72,47.27 0 top
R99  27.15,46.55 0 top
R100  23.42,48.04 270 top
R101  27.15,48.67 0 top
R102  27.11,42.32 0 top
R103  14.72,45.1 0 top
R104  23.34,44.41 270 top
R105  27.14,44.44 0 top
R106  27.1,37.99 0 top
R107  14.72,42.95 0 top
R108  23.34,41.21 270 top
R109  27.1,40.16 0 top
R110  26.28,33.59 0 top
R111  14.72,40.77 0 top
R112  23.34,37.78 270 top
R113  26.28,35.81 180 top
R114  24.73,31.42 0 top
R115  14.72,38.6 0 top
R116  22.11,30.72 90 top
R117  24.71,29.26 0 top
R118  59.13,45.76 180 top
R119  59.14,43.62 180 top
RESET  52.65,11.15 180 top
U$1  7.43,46.15 90 top
U$2  18.15,86.94 0 top
U$3  42.99,30.04 180 top
U$6  41.4,55.51 0 top
U$7  62.71,62.37 90 top
U$8  59.35,48.95 0 top
U$9  12.47,73.66 270 top
U$10  43.1,69.52 270 top
U$11  33.97,70.12 0 top
U$12  54.61,63.31 180 top
U$13  6.72,73.42 270 top
U$14  67.12,62.55 90 top
U$15  16.78,65.72 270 top
U$16  46.44,74.64 90 top
U$17  36.53,74.51 180 top
USER  43.15,11.15 180 top
XBEE  59.63,15.91 270 top

### Tracks (layer width: path | path; a pad name or v marks a point on that pad's centre or on a via)
3.3V  (via drill 0.6)
  Top 0.203: R64.2 35.61,35.71 35.62,35.7 | LED4.AN 83.87,8.23 87.14,11.49
  Top 0.254: U$3.10 49.68,30.79 C2.1 | C3.1 34.83,31.29 U$3.38 34.56,31.29 34.16,31.69 33.15,31.69 | U$3.57 43.24,22.57 43.7,22.11 45.01,22.11 C4.1 46.46,20.56 | C5.1 42.24,38.49 U$3.26 42.24,39.04 42.41,39.2 | 45.74,39.26 U$3.19 | 45.74,39.26 C28.1 | 45.74,39.26 47.23,40.75 | 47.23,40.75 47.26,40.78 | 47.23,40.75 47.4,40.75 47.4,40.99 47.97,40.42 50.77,40.42 | 50.35,40.85 arc-90 49.92,40.42 | 33.15,31.69 32.19,31.69 32.17,31.66 | R64.2 35.61,34.89 v35.24,34.52 | 31.83,32.02 C7.1 32.28,31.77 | 31.83,32.02 31,32.85 R63.2 | 31.83,32.02 arc90 32.28,32.47 | v32.28,34.11 32.28,32.55 arc90 33.15,31.69 | 72.66,35.8 arc90 72.78,35.67 73.09,35.67 arc90 73.53,36.12 | LED1.AN 66.95,54.12 LED2.AN
  Top 0.508: 15.42,4.48 6.18,4.48 5.11,5.56 LED5.A 5.11,9.99 9.26,14.15 23.89,14.15 30.96,21.22 30.94,30.61 C7.1 32.19,31.66 C3.1 | 15.42,4.48 24.05,4.48 | 24.05,4.48 33.29,4.48 | LED6.A 13.99,5.91 15.42,4.48 | LED7.A 22.94,5.6 24.05,4.48 | LED8.A 31.77,5.99 33.29,4.48 | C2.1 C6.1 53.86,32.3 JP9.VDD | 46.33,3.94 46.33,5.33 | 46.33,5.33 arc-90 45.48,4.48 | 33.29,4.48 45.53,4.48 arc-90 46.33,3.68 | 46.33,5.33 46.33,11.08 USER.1 v48.84,13.58 49.41,14.16 R70.1 | 46.46,20.56 C8.1 48.86,18.39 v49.38,18.91 | C9.1 42.37,40.69 C5.1 42.37,42.07 42,42.44 C10.1 | LED1.AN 71.03,52.01 arc-90 72.2,50.84 72.2,37.39 arc-90 70.97,36.16 72.31,36.16 arc-90 72.33,36.14 72.33,36.68 arc90 72.28,36.73 72.28,36.59 arc90 73.2,35.66 | 72.2,37.45 arc90 73.53,36.12
  Top 0.762: C1.2 74.38,21.67 XBEE.1 arc90 79.72,26.82 85.31,26.82 arc-90 85.87,26.25 | LED4.AN 83.87,8.22 LED11.AN 87.14,11.49 | 46.3,4.48 arc-90 46.33,4.46 46.33,3.94 46.33,3.68 46.33,2.68 arc90 47.31,1.7 85.27,1.7 arc90 87.14,3.57 87.14,11.49 87.14,20.33 LED12.AN 85.87,26.25 | JP9.VDD 59.63,39.76 arc-90 60.29,40.42 | IC1.4 64.38,40.42 60.29,40.42 | 60.29,40.42 50.77,40.42 50.35,40.85 46.62,44.25 42.93,44.25 42,43.7 42,42.44 | 85.87,26.25 85.87,32.9 84.34,34.43 C30.1
  Bottom 0.254: v35.24,34.52 32.69,34.52 v32.28,34.11
  Bottom 0.508: v49.38,18.91 49.38,14.12 v48.84,13.58
  pour Top (no thermals): 69.09,37.47 70.23,37.47 71.37,36.32 75.95,36.32 76.58,36.32 77.6,35.31 81.92,35.31 arc-90 82.3,34.92 82.3,33.91 arc-90 81.92,33.53 80.52,33.53 80.26,33.78 77.98,33.78 76.83,34.92 71.5,34.92 70.36,33.78 68.45,33.78 arc-90 68.2,34.04 68.2,37.21 arc-90 68.45,37.47
5V
  pour Top (no thermals): 74.42,41.02 74.42,37.47 arc90 74.8,37.08 76.33,37.08 arc90 76.58,37.34 76.58,38.23 arc-90 76.83,38.48 81.92,38.48 arc90 82.3,38.86 82.3,46.35 arc90 81.79,46.86 80.77,46.86 arc90 80.26,46.35 80.26,42.04 arc-90 79.76,41.53 75.06,41.53 arc90
CTS  (via drill 0.6)
  Top 0.254: U$3.54 41.74,23.14 arc-90 41.1,22.5 40.51,22.5 arc90 40.26,22.15 40.26,17.58 40.73,17.11 53.05,17.11 v54.89,18.95 | v60.05,16.69 63.63,13.11 XBEE.12
  Bottom 0.254: v54.89,18.95 57.78,18.95 v60.05,16.69
EOC
  Top 0.203: U$6.35 48.49,57.31 52.79,53.01 60.69,53.01 R74.1
GND  (via drill 0.6, 1.2)
  Top 0.203: U$6.29 U$6.28 42.39,54.51 v41.4,55.5 | U$6.18 41.2,55.31 U$6.PAD 43.6,53.31 U$6.24
  Top 0.254: 51.23,30.29 C2.2 50.88,30.29 U$3.9 | U$3.41 34.63,29.79 C3.2 | R69.2 38.97,14.5 v37.91,14.5 | U$3.25 42.74,37.29 C5.2 | 45.24,40.46 U$3.20 | 45.24,40.46 C28.2 | 45.24,40.46 45.24,41.33 v46.34,42.43 | C45.2 40.84,48.87 v41.2,49.33 | R2.2 53.14,46.18 v54.06,45.25 | C33.2 43.95,47.93 v42.18,47.02 | R68.1 63.19,45.71 R75.1 63.35,43.61 v64.82,45.09 | R.1 71.63,55.09 v71.96,55.09 | C47.2 62.38,59.5 U$7.A | U$6.PAD v41.4,55.5
  Top 0.508: C2.2 C6.2 54.8,30.59 v54.83,30.62 | C3.2 32.19,29.96 C7.2 | C4.2 C8.2 arc-90 44.74,18.38 43.22,18.38 | 43.22,18.38 43.37,18.53 v43.37,19.53 | C27.- 41.58,20.01 43.22,18.38 | C5.2 44.07,40.69 C9.2 44.05,42.39 C10.2 45.99,42.79 v46.34,42.43 | JP15.1 7.53,38.05 U$1.P$1 | M17.S 21.26,35.55 v21.87,35.53 | R116.1 22.72,29.26 R117.1 23.85,29.25 C46.1 23.83,27.03 v22.24,27.03 | C44.2 31.76,40.63 v34.01,40.63 | C43.2 32.72,44.44 v33.53,43.62 | C39.2 32.51,59.61 v32.99,60.01 | C41.2 31.13,52.88 v31.13,51.3 | v32.65,55.58 32.38,54.99 C40.2 | C35.2 30.11,63.5 v30.53,62.95 | C34.2 28.96,67.18 v29.36,66.78 | U$13.A 11.84,75.57 U$9.A 11.14,77.53 v9.12,77.53 | U$7.A 66.55,59.83 U$14.A 69.07,60.4 v70.14,61.47 | C42.2 32.22,48.68 v32.91,47.99
  Top 0.762: XBEE.10 66.87,21.67 C1.1 | LED3.CAT 84.34,24.23 v83.57,25.01 | C7.2 32.28,29.87 v32.28,26.86
  Bottom 0.254: v37.91,14.5 37.96,14.45 37.96,13.96 | v46.34,42.43 46.62,42.43 46.63,42.42 | v41.2,49.33 41.2,48.68 41.36,48.84 | v54.06,45.25 54.76,45.25 54.89,45.12 | v42.18,47.02 42.63,47.37 42.46,47.19 | v64.82,45.09 64.82,45.67 64.96,45.81 | v71.96,55.09 72.14,55.27 73,55.27
  Bottom 0.508: v54.83,30.62 54.83,30.91 | v43.37,19.53 43.05,19.85 42.79,19.85 | JP15.1 13.58,35.57 v21.87,35.53 21.91,27.36 v22.24,27.03 | 31.91,26.47 31.71,26.67 | v34.01,40.63 34.91,40.63 | v33.53,43.62 33.29,43.62 33.03,43.37 | v32.99,60.01 33.44,59.69 33.67,59.46 | v31.13,51.3 31.13,53.73 v32.65,55.58 | v30.53,62.95 30.57,63.03 30.3,62.76 | v29.36,66.78 29.08,66.78 28.87,66.56 | v9.12,77.53 9.03,77.62 8.47,77.62 | v70.14,61.47 70.14,62.27 69.76,62.65 | v32.91,47.99 32.88,47.99 32.5,47.61
  Bottom 0.762: v83.57,25.01 83.4,25.01 83,24.6 | v32.28,26.86 32.31,26.84 32.31,25.98
  other vias: 84.07,36.45 83.82,31.5
  pour Bottom: 39.87,90.49 85.28,90.47 arc-90 87.82,87.93 87.63,7.62 87.63,3.81 arc-90 85.09,1.27 3.81,1.27 arc-90 1.27,3.81 0.61,87.82 arc-90 3.15,90.36
  pour Top (no thermals): 81.15,37.47 84.07,37.47 arc-90 85.09,36.45 arc-90 84.07,35.43 83.06,35.43 82.55,35.94 80.26,35.94 79.63,36.58 79.5,36.7 78.61,36.7 78.36,36.7 arc-90 78.23,36.83 78.23,37.59 arc-90 78.36,37.72 80.26,37.72 80.39,37.59 80.52,37.47 80.9,37.47
  pour Top (no thermals): 75.18,34.04 76.45,34.04 77.34,33.15 79.5,33.15 80.14,32.51 83.69,32.51 arc-90 84.84,31.37 arc-90 83.82,30.35 80.64,30.35 arc-90 80.26,30.73 80.26,31.11 arc90 79.76,31.62 75.06,31.62 arc-90 74.68,32 74.68,33.78 arc-90 74.93,34.04
  pour Bottom (no thermals): 74.83,75.08 76.92,75.08 76.92,73.05 76.92,71.31 74.89,71.31 72.86,71.31 72.86,73.28 72.86,75.12 74.22,75.12
  pour Bottom (no thermals): 81,61.37 82.6,61.37 82.6,59.98 82.6,59.09 80.37,59.09 80.37,61.4 80.7,61.4
INT  (via drill 0.6)
  Top 0.203: U$6.31 46.13,55.71 46.42,55.42 | 46.42,55.42 49,52.84 49,49.26 45.07,45.34 40.35,45.34 40.13,44.96 40.09,44.04 40.08,41.79 arc45 40.19,41.25 40.79,40.59 40.79,37.24 40.24,36.68 U$3.30 | v52.9,54.36 53.68,53.57 58.03,53.57 61.68,57.23 69.96,57.23 R65.1 | v45.88,54.7 46.42,55.23 46.42,55.42
  Bottom 0.203: v52.9,54.36 46.23,54.36 v45.88,54.7
LED1
  Top 0.254: U$3.43 33.96,28.79 arc90 33.33,28.15 33.33,20.16 26.15,12.98 11.96,12.98 R71.2
LED2
  Top 0.254: U$3.44 34.7,28.29 arc90 34.06,27.65 34.06,18.9 26.81,11.64 R72.2
LED3
  Top 0.254: U$3.45 35.42,27.79 arc90 34.78,27.15 34.78,16.28 30.15,11.64 R77.2
LED4
  Top 0.254: U$3.46 36.12,27.29 arc90 35.48,26.65 35.48,13.05 R78.2
MCLR
  Top 0.254: 52.88,29.29 arc-90 52.9,29.27 52.9,29.29 | 52.9,29.29 U$3.7 | 55.55,29.29 56.35,29.29 | JP9.MCLR arc-90 62.2,38.02 62.2,34.93 arc-45 62.13,34.75 56.74,29.36 arc-45 56.56,29.29 56.35,29.29 | 56.35,29.29 arc90 55.96,28.89 | 55.55,29.29 arc-90 55.96,28.88 55.96,16.23 R70.2 53.88,13.17 RESET.1 | 55.55,29.29 52.9,29.29
N$1
  Top 0.508: U$2.2 21.41,86.93 R1.1
N$2
  Top 0.203: U$6.33 47.65,56.51 50.28,53.89 50.28,50.1 51.47,48.91 53.65,48.91 53.68,48.95
  Top 0.508: U$8.1 53.68,48.95 53.18,48.95 R2.1
N$3
  Top 0.762: XBEE.20 79.63,11 R4.1
N$4
  Top 0.508: U$16.A 49.16,78.21 M12.D
  pour Top (no thermals): 32.83,81.46 33.59,81.46 39.83,87.69 39.85,87.72 45.48,87.72 52.18,81.01 53.81,81.01 53.81,75.36 49.43,75.36 47.68,75.36 47.68,81.01 37.63,81.01 37.63,77.83 37.63,75.72 31.81,75.72 31.39,75.72 31.39,81.43
N$5
  Top 0.762: R3.1 82.01,21.11 LED3.AN
N$6  (via drill 0.6)
  Top 0.762: XBEE.6 69.63,25.74 v71.63,23.74 | v75.21,20.16 80.44,20.16 R3.2
  Bottom 0.762: v75.21,20.16 v71.63,23.74
N$7  (via drill 0.6)
  Top 0.203: U$6.46 40,58.87 arc45 39.82,59.32 37.21,61.93 C36.2
  Top 0.508: U$11.A 30.94,70.12 27.95,73.1 M11.S | U$11.A 32.55,70.12 v33.81,68.85 R9.2 37.34,63.15 C36.2 | R87.1 41.71,74.02 v41.57,74.02 | v38.73,74.04 37.45,72.76 v35.66,72.76 | U$15.3 17.88,68.46 R86.2 19.54,70.12 U$11.A
  Bottom 0.508: v41.57,74.02 41.54,74.04 v38.73,74.04 | v35.66,72.76 33.81,70.91 v33.81,68.85
N$8
  Top 0.762: LED4.CAT 82.5,9.1 R4.2
N$9
  Top 0.762: LED11.CAT 84.05,10.97 R5.2
N$10
  Top 0.762: R6.2 83.6,19.44 LED12.CAT
N$11
  Top 0.762: XBEE.15 69.63,6.91 75.91,13.19 R5.1
N$12
  Top 0.762: XBEE.13 75.11,14.4 80.4,14.4 82.2,16.2 R6.1
N$35
  Top 0.254: U$3.56 42.74,21.74 C27.+
N$86
  Top 0.254: R71.1 10.68,9.88 LED5.K
N$90
  Top 0.254: LED10.CAT 69.44,58.41 R65.2
N$91
  Top 0.203: LED9.CAT 66.94,56.27 R.2
N$92
  Top 0.203: U$6.19 41.6,51.65 42.93,50.33 43.83,49.64 C33.1
N$93
  Top 0.203: U$6.48 38.51,58.39 34.49,62.41 32.33,62.41 29.26,65.48 C34.1
  Top 0.508: R66.2 27.05,65.62 C34.1
N$94
  Top 0.203: U$6.1 34.43,61.81 29.31,61.81 28.73,62.4 26.78,62.4 26.79,62.4 C35.1
  Top 0.508: R67.1 C35.1
N$96
  Top 0.254: R73.2 65.18,52.08 LED1.CAT
N$97
  Top 0.254: R72.1 19.43,9.7 LED6.K
N$98
  Top 0.254: R74.2 LED2.CAT
N$99
  Top 0.254: R77.1 28.57,9.89 LED7.K
N$102
  Top 0.254: R78.1 36.8,9.3 LED8.K
N$105
  Top 0.203: U$6.2 37.99,57.31 33.98,61.32 R80.2
N$106
  Top 0.508: P5.G 22.03,58.87 R79.1 23.92,58.87 R80.1
N$107
  Top 0.203: U$6.3 37.86,56.91 33.88,60.88 30.23,60.88 arc90 29.59,60.25 C39.1
  Top 0.508: C39.1 R89.2
N$110
  Top 0.508: R81.2 38.94,65.23 R9.1 36.51,67.86 U$11.C 33.17,73.46 arc45 32.72,73.65 31.14,73.65 arc-90 30.5,74.28 30.5,80.28 arc90 29.87,80.91 M11.G
N$111
  Top 0.508: M13.G 40.31,74.02 38.23,71.93 38.23,68.95 R8.1 41.13,68.95 U$10.C 40.98,64.86 R82.2
N$112  (via drill 0.6)
  Top 0.203: U$6.43 41.2,60.06 42.28,61.14 42.28,63.23 42.29,63.25 42.29,64.68 43.09,65.48 44.42,65.48 45.34,66.4 45.34,68.85 C38.1
  Top 0.508: C38.1 45.98,72.03 46.81,72.87 | 46.81,72.87 v48.82,72.87 49.37,72.87 49.56,73.07 51.89,75.4 51.89,78.09 | U$16.C 46.81,73.42 46.81,72.87 | U$17.C 38.49,75.63 v38.99,75.63
  Bottom 0.508: v38.99,75.63 46.06,75.63 v48.82,72.87
N$113  (via drill 0.6)
  Top 0.508: R83.2 45.17,63.5 R7.1 45.62,65.14 v46.34,65.86 | M12.G 52.07,70.83 U$12.C 53.67,63.31 v54.55,64.19
  Bottom 0.508: v54.55,64.19 52.87,65.86 v46.34,65.86
N$114
  Top 0.203: U$6.41 42,58.97 arc-45 42.19,59.42 43.38,60.61 arc-45 43.82,60.8 44.26,60.8 arc90 44.9,61.43 44.9,61.51 arc-90 45.53,62.14 45.87,62.14 C37.1
N$115
  Top 0.203: U$6.40 42.4,58.67 arc-45 42.56,59.23 43.55,60.22 arc-45 44.03,60.3 45.73,60.3 C37.2
N$116
  Top 0.203: U$6.39 42.8,58.91 43.66,59.77 46.98,59.7 arc90 47.31,60.03 47.31,62.13 arc-90 47.94,62.76 48.24,62.76 arc45 48.69,62.95 50.01,64.28 50.01,67.14 C38.2
N$117
  Top 0.203: U$6.38 43.2,58.77 43.76,59.33 50.65,59.31 R84.1
N$118
  Top 0.203: U$6.37 49.79,58.39 51.3,56.88 53.33,56.88 R85.1
N$119
  Top 0.508: R8.2 41.69,70.65 U$10.A 44.41,73.37 R87.2 44.95,75.55 44.95,78.77 44.88,78.7 M13.S
N$120
  Top 0.508: P5.D 15.57,55.61 R88.2
N$121
  Top 0.203: U$6.4 37.7,56.51 35.74,58.47 31.98,58.59 30.58,57.17 28.05,57.07 R90.2
N$123
  Top 0.508: P6.G 21.76,53.74 R91.1 24.66,55.41 R90.1
N$124
  Top 0.508: P6.D 18.27,54.2 R92.1
N$126
  Top 0.508: P7.G 22.27,50.36 R95.1 24.22,50.79 R94.1
N$127  (via drill 0.6)
  Top 0.203: U$6.6 37.49,55.71 36.97,56.24 33.27,56.24 v32.38,57.12 | R94.2 29.23,50.79 v29.29,50.74
  Bottom 0.203: v29.29,50.74 29.29,54.03 v32.38,57.12
N$128
  Top 0.203: U$6.5 37.59,56.11 35.65,58.05 32.07,58.05 31.56,57.54 31.56,57.14 C40.1
  Top 0.508: C40.1 R93.2
N$129
  Top 0.508: P7.D 16.35,49.39 R96.2
N$130
  Top 0.203: U$6.7 37.31,55.31 36.8,55.82 34.24,55.78 32.35,53.94 29.41,53.94 C41.1
  Top 0.508: C41.1 R97.1
N$132
  Top 0.508: P8.D 17.65,47.27 R98.2
N$133
  Top 0.203: U$6.8 37.01,54.91 36.63,55.3 34.28,55.24 33.01,53.98 32.99,51.92 34.1,50.81 34.1,46.55 R99.2
N$134
  Top 0.508: R99.1 25.65,47.19 R100.2 23.17,46.94 P8.G
N$135  (via drill 0.6)
  Top 0.203: U$6.9 36.83,54.51 36.5,54.84 34.52,54.84 34.52,53.98 34.28,53.73 v33.91,53.73 | v32.64,50.57 31.74,49.67 29.41,49.67 29.36,49.62 C42.1
  Top 0.508: R101.2 C42.1
  Bottom 0.203: v33.91,53.73 32.64,52.46 v32.64,50.57
N$137
  Top 0.203: R102.2 34.99,42.32 34.99,54.3 36.46,54.3 36.66,54.11 U$6.10
N$138
  Top 0.508: M14.G 23.33,43.58 R104.2 25.02,43.56 R102.1
N$139
  Top 0.508: R103.2 16.14,44.53 M14.D
N$140  (via drill 0.6)
  Top 0.203: U$6.11 36.2,53.71 v35.88,53.39 | v33.97,52.27 34.54,51.7 34.54,45.4 30.86,45.4 30.29,44.83 C43.1
  Top 0.508: R105.2 C43.1
  Bottom 0.203: v33.97,52.27 34.76,52.27 v35.88,53.39
N$142  (via drill 0.6)
  Top 0.203: R106.2 27.95,38.29 31.64,38.29 32.98,39.64 36.34,39.64 arc90 36.97,40.27 36.97,49.12 v36.84,49.25 | U$6.12 37.77,53.31 v36.35,51.89
  Bottom 0.203: v36.84,49.25 36.84,51.4 36.74,51.5 v36.35,51.89
N$143
  Top 0.508: M15.G 20.57,40.36 R108.2 23.95,40.36 26.25,38.06 R106.1
N$144
  Top 0.508: R107.2 17.26,41.26 M15.D
N$145
  Top 0.203: U$6.13 38.74,52.64 35.52,49.42 35.52,41.78 31.24,41.78 C44.1
  Top 0.508: R109.2 29.62,40.16 C44.1
N$147
  Top 0.508: M16.G 20.6,36.91 20.62,36.93 R112.2 23.34,35.67 R110.1
N$148  (via drill 0.6)
  Top 0.203: R110.2 28.6,33.59 arc90 29.23,34.23 29.23,36.82 arc-90 29.87,37.45 32.18,37.45 33.43,38.7 37.63,38.7 arc90 38.27,39.33 38.27,39.76 arc45 38.08,40.2 37.92,40.36 37.92,41.64 37.94,41.66 37.94,46.98 arc-45 38.12,47.43 v38.52,47.83 | U$6.14 39.6,52.03 38.28,50.71 v38.28,50.19
  Bottom 0.203: v38.52,47.83 38.52,49.82 38.52,49.95 v38.28,50.19
N$149
  Top 0.508: R111.2 18.27,38.07 M16.D
N$150
  Top 0.203: R113.1 28.22,35.81 arc90 28.78,36.45 28.79,37.24 arc-90 29.49,37.88 31.81,37.88 33.15,39.18 37.16,39.18 arc90 37.8,39.81 37.58,40.03 arc-45 37.39,40.48 37.39,47.99 C45.1 40,50.61 U$6.15
N$152
  Top 0.203: R114.2 29.07,31.42 arc90 29.7,32.05 29.7,36.36 arc-90 30.34,36.99 32.32,36.99 33.53,38.2 38.05,38.2 arc90 38.68,38.84 38.68,39.97 arc45 38.5,40.42 38.41,40.51 38.41,45.86 arc-45 38.59,46.31 40.03,47.75 40.97,47.75 42.23,49.01 42.23,49.5 arc45 42,49.87 40.4,51.53 U$6.16
N$153
  Top 0.508: R116.2 arc90 21.97,31.71 | R114.1 22.26,31.42 arc-90 R116.2 | R116.2 22.11,32.05 M17.G
N$154
  Top 0.508: R115.2 15.57,37.29 M17.D
N$155
  Top 0.203: R117.2 29.55,29.26 arc90 30.19,29.9 30.19,35.95 arc-90 30.82,36.59 32.51,36.59 33.71,37.78 38.47,37.78 arc90 39.1,38.42 39.1,40.15 arc45 38.92,40.6 38.86,40.65 38.86,45.71 arc-45 39.05,46.16 39.99,47.1 40.98,47.1 42.76,48.88 42.76,49.58 arc45 42.5,50.13 40.8,51.86 U$6.17
  Top 0.508: C46.2 25.56,27.06 R117.2
N$156
  Top 0.203: U$6.45 40.4,60.07 arc45 40.22,60.52 R81.1
N$157
  Top 0.203: U$6.44 40.8,61.62 R82.1
N$158
  Top 0.203: U$6.42 41.6,59.28 arc-45 41.79,59.73 R83.1
N$159  (via drill 0.6)
  Top 0.203: v51.42,43.94 52.6,42.76 57.38,42.76 58.24,43.62 R119.2 | U$6.22 42.8,52.19 43.66,51.33 46.58,51.33 v47.03,50.89
  Top 0.254: R119.2 58.29,45.74 R118.2
  Bottom 0.203: v47.03,50.89 47.05,50.7 50.23,47.52 50.23,45.14 v51.42,43.94
N$160  (via drill 0.6)
  Top 0.203: v48.17,45.97 52.02,42.13 59.55,42.13 59.99,42.57 R119.1 | v45.73,48.44 45.34,48.83 45.34,49.9 44.67,50.57 43.37,50.57 42,51.94 U$6.20
  Top 0.254: R119.1 60.82,43.62 | 60.82,43.62 61.48,43.62 R75.2 | JP11.2 66.19,44.1 64.24,42.15 62.29,42.15 60.82,43.62
  Bottom 0.203: v45.73,48.44 45.73,48.41 v48.17,45.97
N$161  (via drill 0.6)
  Top 0.203: v49,46.91 50.33,46.91 53.33,43.92 55.72,43.92 56.67,44.87 56.67,46.05 57.67,47.05 58.69,47.05 R118.1 | U$6.21 42.4,52.09 43.54,50.95 45.01,50.95 v46.34,49.62
  Top 0.254: R118.1 61.44,45.76 R68.2 62.67,46.97 64.06,46.97 67.41,50.31 JP10.2
  Bottom 0.203: v46.34,49.62 46.34,49.57 v49,46.91
P+  (via drill 0.6)
  Top 0.508: U$12.A 57.15,62.41 | R7.2 47.66,64.29 v48.6,64.29 | v49.92,62.75 49.92,61.73 R84.2 | R1.2 29.93,89.62 50.57,89.62 57.07,83.12 57.07,81.53 arc90 57.77,80.83 56.4,80.83 arc90 56.25,80.68 arc90 57.09,81.52 | 57.09,81.52 57.09,82.46 | 57.09,81.52 57.09,80.57 arc90 M12.S
  Top 0.762: 69.91,69.01 69.91,67.49 U$14.C 62.92,64.7 U$7.C 61.11,63.31 57.65,63.31 | 57.65,63.31 U$12.A | R84.2 52.12,59.56 R85.2 57.65,62.9 57.65,63.31
  Top 1.27: JP16.2 79.28,58.16 68.54,68.9 | 68.54,68.9 68.43,69.01 69.91,69.01 74.92,69.01 JP1.1 | M12.S 68.54,69.11 68.54,68.9
  Bottom 0.508: v48.6,64.29 49.92,62.97 v49.92,62.75
  pour Top (no thermals): 74.6,70.82 75.11,70.82 arc-90 76.59,69.33 76.59,68.87 arc-90 74.82,67.09 62.43,67.09 arc-90 61.57,67.96 61.57,70.37 arc-90 62.15,70.95
PGEC1
  Top 0.254: JP9.PGEC 49.68,35.74 47.27,35.74 arc90 46.74,35.2 U$3.17 | 47.27,35.74 arc-90 46.75,36.26 arc90 46.74,36.25 U$3.17 | U$3.17 arc90 U$3.17
PGED1
  Top 0.254: U$3.18 46.24,37.34 48.46,39.56 53.05,39.56 JP9.PGED
PSD  (via drill 0.6)
  Top 0.203: U$3.28 41.25,40.76 40.61,41.47 arc-45 40.5,41.93 40.55,44.56 40.73,44.93 45.49,44.93 49.53,48.97 | 49.53,48.97 49.62,49.06 49.62,53.39 46.9,56.11 U$6.32 | LED9.AN 61.92,56.29 v59.73,54.09 | v58.93,51.04 52.27,51.04 v51.49,50.25 | v50.7,48.35 50.08,48.97 49.53,48.97
  Bottom 0.203: v59.73,54.09 59.73,51.84 v58.93,51.04 | v51.49,50.25 51.49,49.14 v50.7,48.35
RGO  (via drill 0.6)
  Top 0.203: U$6.36 49.63,57.71 51.09,56.25 55.22,56.25 C47.1
  Top 0.254: LED10.AN 64.58,57.8 C47.1 56.77,55.64 v57.62,54.79 | U$8.2 58.83,48.95 v58.52,49.25
  Bottom 0.254: v58.52,49.25 57.62,50.15 v57.62,54.79
RTS  (via drill 0.6)
  Top 0.254: U$3.55 42.24,22.61 arc-90 41.6,21.97 41.02,21.97 arc90 40.77,21.72 40.77,18 41.2,17.56 51.71,17.56 v54.91,20.77 | v60.59,18.48 60.59,18.41 v68.95,10.06
  Bottom 0.254: v54.91,20.77 58.31,20.77 v60.59,18.48 | v68.95,10.06 71.63,7.38 XBEE.16
RX  (via drill 0.6)
  Top 0.254: U$3.50 39.74,17.31 40.63,16.42 53.15,16.42 53.85,17.12 v55.02,17.12 | v57.16,17.12 57.16,28.49 58.36,29.68 74.86,29.68 XBEE.2
  Bottom 0.254: v55.02,17.12 v57.16,17.12
SCL
  Top 0.203: 32.15,35.63 33.84,37.31 38.88,37.31 arc90 39.51,37.95 39.51,40.52 arc45 39.32,40.97 arc-45 39.27,41.1 39.27,45.53 40.02,46.28 44.72,46.28 47.85,49.42 47.85,51.94 46.48,53.31 U$6.25
  Top 0.254: U$3.37 35.99,31.79 32.15,35.63 R63.1
SD
  Top 0.203: U$6.34 48.02,56.91 52.65,52.27 61.66,52.27 R73.1
SDA
  Top 0.203: U$6.27 U$6.26 46.86,53.71 48.36,52.21 48.36,49.26 44.91,45.81 40.16,45.81 39.69,45.26 39.64,41.21 40.27,40.46 40.32,37.74 39.43,36.91 39.41,36.88 38.8,36.88 38.57,36.72 34.57,36.72 arc90 34.31,36.4 R64.1
  Top 0.254: U$3.36 36.24,32.28 33.19,35.5 33.19,35.93 33.25,35.94 R64.1
TX  (via drill 0.6)
  Top 0.254: U$3.49 39.24,16.95 40.59,15.6 v54.15,15.6 | v58.59,15.65 58.59,28.38 58.9,28.7 74.09,28.7 76.1,26.7
  Top 0.406: 76.1,26.7 75.63,26.7 XBEE.3
  Bottom 0.254: v54.15,15.6 58.53,15.6 v58.59,15.65
USER
  Top 0.254: U$3.42 38.29,29.29 arc-90 38.56,29.02 38.56,16.61 R69.1 40.91,12.15 USER.2
VC1  (via drill 0.6)
  Top 0.508: U$1.P$2 7.5,40.08 JP14.1 12.13,38.59 R115.1 | M16.S 20.83,38.91 v21.64,38.9 21.91,38.63 R112.1 | R112.1 23.62,38.35 | R113.2 25.35,35.81 24.71,36.45 24.71,37.62 23.7,38.63 R112.1
  Bottom 0.508: v21.64,38.9 11.82,38.9 JP14.1
VC2  (via drill 0.6)
  Top 0.508: U$1.P$3 7.47,42.11 JP13.1 11.99,40.77 R111.1 | M15.S 21.03,42.23 v21.55,42.23 21.72,42.06 R108.1 24.35,42.06 R109.1
  Bottom 0.508: v21.55,42.23 10.76,42.23 JP13.1
VC3  (via drill 0.6)
  Top 0.508: U$1.P$4 JP12.1 11.84,42.95 R107.1 | M14.S 20.84,45.48 v21.55,45.47 23.14,45.47 R104.1 | R104.1 23.38,45.26 | R105.1 25.46,45.26 R104.1
  Bottom 0.508: JP12.1 20.23,44.15 v21.55,45.47
VC4  (via drill 0.6)
  Top 0.508: U$1.P$5 7.46,46.18 JP6.1 11.72,45.1 R103.1 | P8.S v21.55,48.83 23.36,48.83 R100.1 23.65,48.67 R101.1
  Bottom 0.508: JP6.1 18.9,46.18 v21.55,48.83
VC5  (via drill 0.6)
  Top 0.508: U$1.P$6 7.49,48.21 JP5.1 11.58,47.27 R98.1 R96.1 | R97.2 25.79,52.9 v25.02,52.12
  Bottom 0.508: v25.02,52.12 25.02,50.38 12.81,50.38 JP5.1
VC6  (via drill 0.6)
  Top 0.508: U$1.P$7 7.52,50.24 JP4.1 11.9,51.5 R92.2 | P7.S 20.55,52.22 v21.55,52.22 22.58,53.25 R95.2 24.59,53.25 R93.1
  Bottom 0.508: v21.55,52.22 12.62,52.22 JP4.1
VC7  (via drill 0.6)
  Top 0.508: U$1.P$8 7.55,52.27 JP3.1 11.98,53.61 R88.1 | P6.S 20.66,55.65 v21.55,55.65 23.01,57.11 R91.2 24.26,57.11 R89.1
  Bottom 0.508: v21.55,55.65 14.02,55.65 JP3.1
VC8  (via drill 0.6)
  Top 0.203: U$6.47 39.6,58.61 arc45 39.42,59.06 35.51,62.9 C36.1
  Top 0.508: U$1.P$9 7.58,54.3 JP2.1 16.05,59.26 P5.S 21.83,60.56 R79.2 23.48,60.64 R67.2 | R67.2 23.39,63.49 | R67.2 23.43,63.54 R66.1 23.43,67.35 24.66,68.58 29.95,68.58 C36.1 | 12.32,71.27 U$13.C | 12.32,71.27 U$9.C 12.79,71.12 R86.1 15.78,68.13 U$15.1 U$15.2 17.06,63.49 R67.2 | U$2.1 16.37,85.47 16.37,73 | 16.37,73 14.64,71.27 12.32,71.27 | U$17.A 34.92,74.51 v34.42,74 | v26.44,73.18 16.55,73.18 16.37,73
  Bottom 0.508: v34.42,74 27.27,74 v26.44,73.18

### Text on the board
tPlace: 1k | IRFR3806 | WAKEUP | 200 | PMEG | PMEG | J40 | CA | J5367 | 43V | 1M | GND | J53 | 18V | J53 | 18V | 1mOhm | 47nF 50V | 4.7nF | 1k | 1M | P+ | MMBD | 7000HS | 47nF | 1M | 1k | J53 | 18V | J40 | CA | 10k | 47nF | 1nF | J5367 | 43V | 100 | 100 | 100 | GND | 1k | 4.7nF | 1k | 300k | IRLML | 10k | INT | P+ | 47nF | 500 | 500 | .1uF | PSD | 1k | 100 | 300k | 1k | 8 | EOC | IRLML | 1k | 1k | 7 | 47nF | FETSOFF | 1k | SD | 300k | ISL94203 | 6 | IRLML | 10k | 47nF | 10k | 1k | 5 | 300k | GND | AO34 | 47nF | 4 | 300k | 10k | .1uF | 10k | 47nF | 22k | 5V | 10uF | 3 | AO34 | 1k | 22k | 10k | 300k | 10k | 2 | 10uF | .1uF | AO34 | .1uF | 1 | 300k | 1k | 47nF | .1uF | 10k | .01uF | 0 | AO34 | 1k | 1k | 1k | AO34 | 10k | .01uF | .01uF | 10k | 1117 | 300k | 10uF | 1k | .1uF | .1uF | .1uF | 47nF | RSSI | SLEEP | 10uF | .01uF | .1uF | 1k | .1uF | 2.2k | 1k | 2.2k | 1k | XBee | 1k | 1k | 1k | 1k | 1k | 1 | 2 | 3 | 4 | ASSOC | USER | RESET | ON/OFF | GND
bPlace: 10k Thermistor | 10k Thermistor